# EAGLE design PoE (EAGLE 6.4)
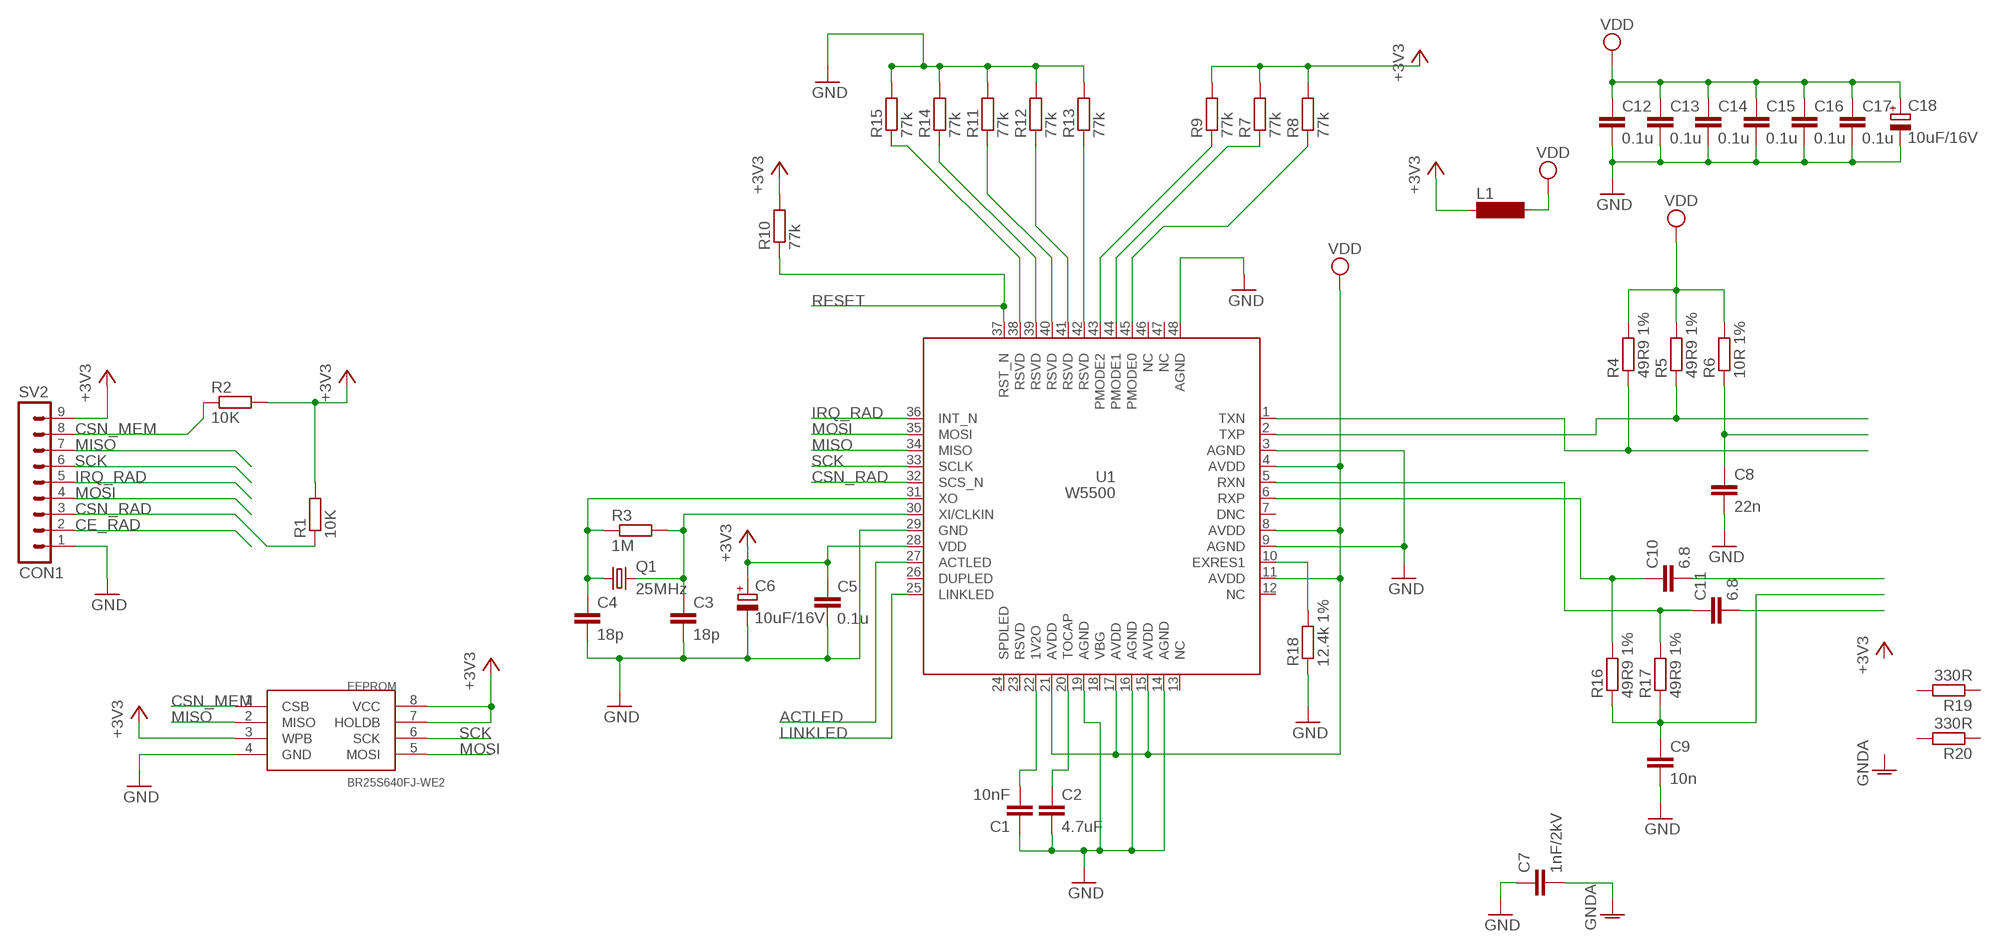
[diagram p0: schematic, sheet 1]

## Parts
C1  10nF  C-EUC1206  [C1206]
C2  4.7uF  C-EUC1206  [C1206]
C3  18p  C-EUC1206  [C1206]
C4  18p  C-EUC1206  [C1206]
C5  0.1u  C-EUC1206  [C1206]
C6  10uF/16V  CPOL-EU153CLV-0505  [153CLV-0505]
C7  1nF/2kV  C-EUC1206  [C1206]
C8  22n  C-EUC1206  [C1206]
C9  10n  C-EUC1206  [C1206]
C10  6.8  C-EUC1206  [C1206]
C11  6.8  C-EUC1206  [C1206]
C12  0.1u  C-EUC1206  [C1206]
C13  0.1u  C-EUC1206  [C1206]
C14  0.1u  C-EUC1206  [C1206]
C15  0.1u  C-EUC1206  [C1206]
C16  0.1u  C-EUC1206  [C1206]
C17  0.1u  C-EUC1206  [C1206]
C18  10uF/16V  CPOL-EU153CLV-0405  [153CLV-0405]
EEPROM  BR25S640FJ-WE2  [SO8]
L1  MS50  [MS50]
Q1  25MHz  CRYSTALHC49UP  [HC49UP]
R1  10K  R-EU_R1206  [R1206]
R2  10K  R-EU_R1206  [R1206]
R3  1M  R-EU_R1206  [R1206]
R4  49R9 1%  R-EU_R1206  [R1206]
R5  49R9 1%  R-EU_R1206  [R1206]
R6  10R 1%  R-EU_R1206  [R1206]
R7  77k  R-EU_R1206  [R1206]
R8  77k  R-EU_R1206  [R1206]
R9  77k  R-EU_R1206  [R1206]
R10  77k  R-EU_R1206  [R1206]
R11  77k  R-EU_R1206  [R1206]
R12  77k  R-EU_R1206  [R1206]
R13  77k  R-EU_R1206  [R1206]
R14  77k  R-EU_R1206  [R1206]
R15  77k  R-EU_R1206  [R1206]
R16  49R9 1%  R-EU_R1206  [R1206]
R17  49R9 1%  R-EU_R1206  [R1206]
R18  12.4k 1%  R-EU_R1206  [R1206]
R19  330R  R-EU_R1206  [R1206]
R20  330R  R-EU_R1206  [R1206]
SV2  CON1  MA09-1W  [MA09-1W]
U1  W5500  [W5500]

## Nets
+3V3: C5.1 C6.+ EEPROM.3(WPB) EEPROM.7(HOLDB) EEPROM.8(VCC) L1.1 R1.2 R2.2 R7.2 R8.2 R9.2 R10.2 SV2.9 U1.28(VDD)
ACTLED: U1.27(ACTLED)
CE_RAD: SV2.2
CSN_MEM: EEPROM.1(CSB) R2.1 SV2.8
CSN_RAD: R1.1 SV2.3 U1.32(SCS_N)
GND: C1.1 C2.2 C3.2 C4.2 C5.2 C6.- C7.1 C8.2 C9.2 C12.2 C13.2 C14.2 C15.2 C16.2 C17.2 C18.- EEPROM.4(GND) R11.2 R12.2 R13.2 R14.2 R15.2 R18.1 SV2.1 U1.3(AGND) U1.9(AGND) U1.14(AGND) U1.16(AGND) U1.19(AGND) U1.29(GND) U1.48(AGND)
GNDA: C7.2
IRQ_RAD: SV2.5 U1.36(INT_N)
LINKLED: U1.25(LINKLED)
MISO: EEPROM.2(MISO) SV2.7 U1.34(MISO)
MOSI: EEPROM.5(MOSI) SV2.4 U1.35(MOSI)
N$1: R9.1 U1.43(PMODE2)
N$2: C1.2 U1.22(1V2O)
N$3: C2.1 U1.20(TOCAP)
N$4: C4.1 Q1.1 R3.1 U1.31(XO)
N$5: C3.1 Q1.2 R3.2 U1.30(XI/CLKIN)
N$6: R7.1 U1.44(PMODE1)
N$7: C11.1 R17.2 U1.5(RXN)
N$8: R8.1 U1.45(PMODE0)
N$9: R15.1 U1.38(RSVD)
N$10: R14.1 U1.39(RSVD)
N$11: R11.1 U1.40(RSVD)
N$12: R12.1 U1.41(RSVD)
N$13: R13.1 U1.42(RSVD)
N$14: R5.1 U1.2(TXP)
N$16: C8.1 R6.1
N$17: R4.1 U1.1(TXN)
N$18: C10.1 R16.2 U1.6(RXP)
N$19: C9.1 R16.1 R17.1
N$20: C11.2
N$21: C10.2
N$22: R18.2 U1.10(EXRES1)
RESET: R10.1 U1.37(RST_N)
SCK: EEPROM.6(SCK) SV2.6 U1.33(SCLK)
VDD: C12.1 C13.1 C14.1 C15.1 C16.1 C17.1 C18.+ L1.2 R4.2 R5.2 R6.2 U1.4(AVDD) U1.8(AVDD) U1.11(AVDD) U1.15(AVDD) U1.17(AVDD) U1.21(AVDD)
Unconnected: R19.1 R19.2 R20.1 R20.2 U1.7(DNC) U1.12(NC) U1.13(NC) U1.18(VBG) U1.23(RSVD) U1.24(SPDLED) U1.26(DUPLED) U1.46(NC) U1.47(NC)

## Library data of the parts
C1-C5 C7-C17 = rcl:C-EU: CAPACITOR, European symbol
C6 C18 = rcl:CPOL-EU: POLARIZED CAPACITOR, European symbol
EEPROM = eeprom:BR25S640FJ-WE2
L1 = inductor-neosid:MS50: INDUCTOR SMD power inductor; OC_FARNELL: unknown; OC_NEWARK: unknown
Q1 = crystal:CRYSTAL: CRYSTAL; OC_FARNELL: unknown; OC_NEWARK: unknown
R1-R20 = resistor:R-EU_: RESISTOR, European symbol
SV2 = con-lstb:MA09-1W: PIN HEADER; OC_FARNELL: unknown; OC_NEWARK: unknown
U1 = W5500:W5500

## Board
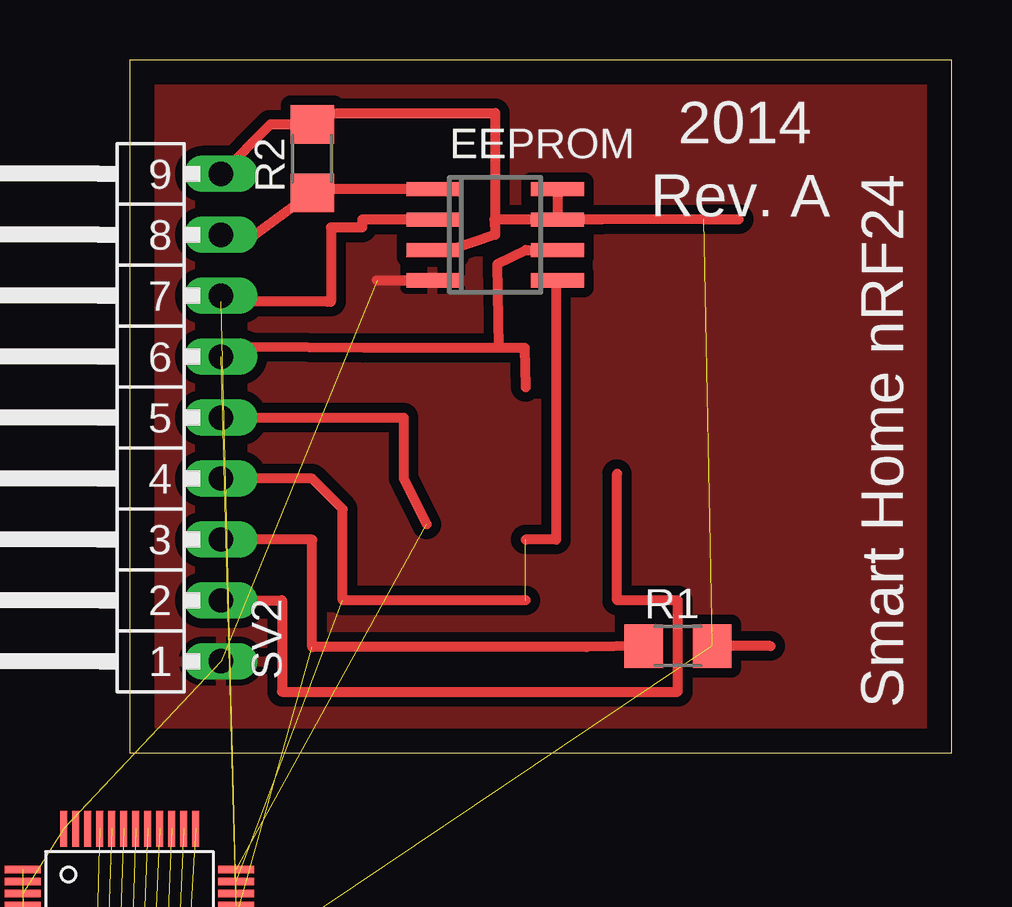
[diagram p1: board, top side]

Size 34.27 x 28.88 mm. Coordinates in mm from the lower left corner, seen from the top.
Outline: 0,0 34.27,0 34.27,28.88 0,28.88 0,0
Copper layers (1*16): Top 0.035mm / dielectric 1.5mm / Bottom 0.035mm
Design rules "default": minimum track width 10mil, minimum drill 24mil, track to track 8mil, track to pad 8mil, pad to pad 8mil, via to via 8mil, smd to smd 8mil, copper to edge 40mil, drill to drill 8mil, minimum pad ring 10mil, minimum via ring 8mil, stop-mask expansion 4mil, vias tented up to drill 0mil, thermal gap 10mil

### Footprints (pad centres in the part's own frame; a part is rotated, then mirrored left to right if it is on the bottom)
C1206 = smd 1.6 x 1.8: 1 -1.4,0; 2 1.4,0
153CLV-0505 = smd 3 x 1.6: + 2.2,0; - -2.2,0
153CLV-0405 = smd 2.6 x 1.6: + 1.8,0; - -1.8,0
SO8 = smd 0.6 x 2.2: 1 -1.905,-2.6; 2 -0.635,-2.6; 3 0.635,-2.6; 4 1.905,-2.6; 5 1.905,2.6; 6 0.635,2.6; 7 -0.635,2.6; 8 -1.905,2.6
MS50 = smd 2.8 x 1.4: 1 0,-1.7; 2 0,1.7
HC49UP = smd 5.334 x 1.93: 1 -4.826,0; 2 4.826,0
R1206 = smd 1.6 x 1.803: 1 -1.422,0; 2 1.422,0
MA09-1W = drill 1.016 long: 1 -10.16,0; 2 -7.62,0; 3 -5.08,0; 4 -2.54,0; 5 0,0; 6 2.54,0; 7 5.08,0; 8 7.62,0; 9 10.16,0
W5500 = smd 1.5 x 0.3: 1 -4.45,2.75; 2 -4.45,2.25; 3 -4.45,1.75; 4 -4.45,1.25; 5 -4.45,0.75; 6 -4.45,0.25; 7 -4.45,-0.25; 8 -4.45,-0.75; 9 -4.45,-1.25; 10 -4.45,-1.75; 11 -4.45,-2.25; 12 -4.45,-2.75; 25 4.45,-2.75; 26 4.45,-2.25; 27 4.45,-1.75; 28 4.45,-1.25; 29 4.45,-0.75; 30 4.45,-0.25; 31 4.45,0.25; 32 4.45,0.75; 33 4.45,1.25; 34 4.45,1.75; 35 4.45,2.25; 36 4.45,2.75 | smd 0.3 x 1.5: 13 -2.75,-4.45; 14 -2.25,-4.45; 15 -1.75,-4.45; 16 -1.25,-4.45; 17 -0.75,-4.45; 18 -0.25,-4.45; 19 0.25,-4.45; 20 0.75,-4.45; 21 1.25,-4.45; 22 1.75,-4.45; 23 2.25,-4.45; 24 2.75,-4.45; 37 2.75,4.45; 38 2.25,4.45; 39 1.75,4.45; 40 1.25,4.45; 41 0.75,4.45; 42 0.25,4.45; 43 -0.25,4.45; 44 -0.75,4.45; 45 -1.25,4.45; 46 -1.75,4.45; 47 -2.25,4.45; 48 -2.75,4.45

### Placement (x,y rotation side)
C1  1.27,-19.05 0 top  (outside the outline)
C2  1.27,-27.94 0 top  (outside the outline)
C3  -2.54,-34.29 0 top  (outside the outline)
C4  -2.54,-50.8 0 top  (outside the outline)
C5  -2.54,-77.47 0 top  (outside the outline)
C6  1.27,-86.36 0 top  (outside the outline)
C7  -2.54,-152.4 0 top  (outside the outline)
C8  -2.54,-158.75 0 top  (outside the outline)
C9  -2.54,-186.69 0 top  (outside the outline)
C10  -2.54,-193.04 0 top  (outside the outline)
C11  -2.54,-199.39 0 top  (outside the outline)
C12  -2.54,-205.74 0 top  (outside the outline)
C13  -2.54,-212.09 0 top  (outside the outline)
C14  -2.54,-218.44 0 top  (outside the outline)
C15  -2.54,-224.79 0 top  (outside the outline)
C16  -2.54,-231.14 0 top  (outside the outline)
C17  -2.54,-237.49 0 top  (outside the outline)
C18  -2.54,-245.11 0 top  (outside the outline)
EEPROM  15.24,21.59 270 top
L1  -2.54,-165.1 0 top  (outside the outline)
Q1  2.54,-41.91 0 top  (outside the outline)
R1  22.86,4.45 0 top
R2  7.62,24.77 90 top
R3  -2.54,-57.15 0 top  (outside the outline)
R4  -2.54,-62.23 0 top  (outside the outline)
R5  -2.54,-67.31 0 top  (outside the outline)
R6  -2.54,-72.39 0 top  (outside the outline)
R7  -2.54,-95.25 0 top  (outside the outline)
R8  -2.54,-101.6 0 top  (outside the outline)
R9  -2.54,-107.95 0 top  (outside the outline)
R10  -2.54,-114.3 0 top  (outside the outline)
R11  -2.54,-120.65 0 top  (outside the outline)
R12  -2.54,-127 0 top  (outside the outline)
R13  -2.54,-133.35 0 top  (outside the outline)
R14  -2.54,-139.7 0 top  (outside the outline)
R15  -2.54,-146.05 0 top  (outside the outline)
R16  -2.54,-171.45 0 top  (outside the outline)
R17  -2.54,-176.53 0 top  (outside the outline)
R18  -2.54,-181.61 0 top  (outside the outline)
R19  -2.54,-252.73 0 top  (outside the outline)
R20  -2.54,-259.08 0 top  (outside the outline)
SV2  3.81,13.97 90 top
U1  0,-7.62 0 top  (outside the outline)

### Tracks (layer width: path | path; a pad name or v marks a point on that pad's centre or on a via)
+3V3  (9 unrouted)
  Top 0.406: EEPROM.8 EEPROM.7 | SV2.9 5.87,26.19 R2.2 8.1,26.67 15.24,26.67 15.24,21.59 | EEPROM.7 15.21,22.23 15.24,21.59 | 15.24,21.59 13.34,20.95 EEPROM.3 | EEPROM.7 19.68,22.23 23.93,22.24 25.4,22.24 | 26.72,4.45 R1.2
CE_RAD
  Top 0.406: SV2.2 6.35,6.35 6.35,2.54 22.86,2.54 22.86,6.35 20.32,6.35 20.32,11.62
CSN_MEM
  Top 0.406: EEPROM.1 8.41,23.5 R2.1 5.23,21.59 SV2.8
CSN_RAD  (1 unrouted)
  Top 0.406: SV2.3 7.62,8.89 7.62,4.41 19.05,4.41 R1.1
GND  (30 unrouted)
  Top 0.406: EEPROM.4 10.31,19.68
  pour Top (isolate 0.406): 0,27.94 0,-1.27 34.29,-1.27 34.29,27.94
IRQ_RAD  (1 unrouted)
  Top 0.406: SV2.5 11.43,13.97 11.43,11.43 12.38,9.53
MISO  (1 unrouted)
  Top 0.406: EEPROM.2 9.7,22.23 9.7,21.9 8.4,21.9 8.4,18.8 8.26,18.8 3.81,18.8 SV2.7
MOSI  (2 unrouted)
  Top 0.406: EEPROM.5 17.78,19.62 17.78,8.89 16.51,8.89 | 16.51,6.35 8.89,6.35 8.89,10.16 7.62,11.43 SV2.4
N$1  (1 unrouted)
N$2  (1 unrouted)
N$3  (1 unrouted)
N$4  (3 unrouted)
N$5  (3 unrouted)
N$6  (1 unrouted)
N$7  (2 unrouted)
N$8  (1 unrouted)
N$9  (1 unrouted)
N$10  (1 unrouted)
N$11  (1 unrouted)
N$12  (1 unrouted)
N$13  (1 unrouted)
N$14  (1 unrouted)
N$16  (1 unrouted)
N$17  (1 unrouted)
N$18  (2 unrouted)
N$19  (2 unrouted)
N$22  (1 unrouted)
RESET  (1 unrouted)
SCK  (1 unrouted)
  Top 0.406: 16.47,16.88 15.4,16.9 15.34,20.39 16.51,20.95 EEPROM.6 | 16.47,16.88 9.79,16.88 5.12,16.91 SV2.6 | 16.47,16.88 16.51,15.24
VDD  (16 unrouted)

### Text on the board
tPlace: 2014 | Rev. A | Smart Home nRF24